# Altium schematic sheet STM32_Schematic.SchDoc
size A3; SheetNumber: 1; SheetTotal: 1
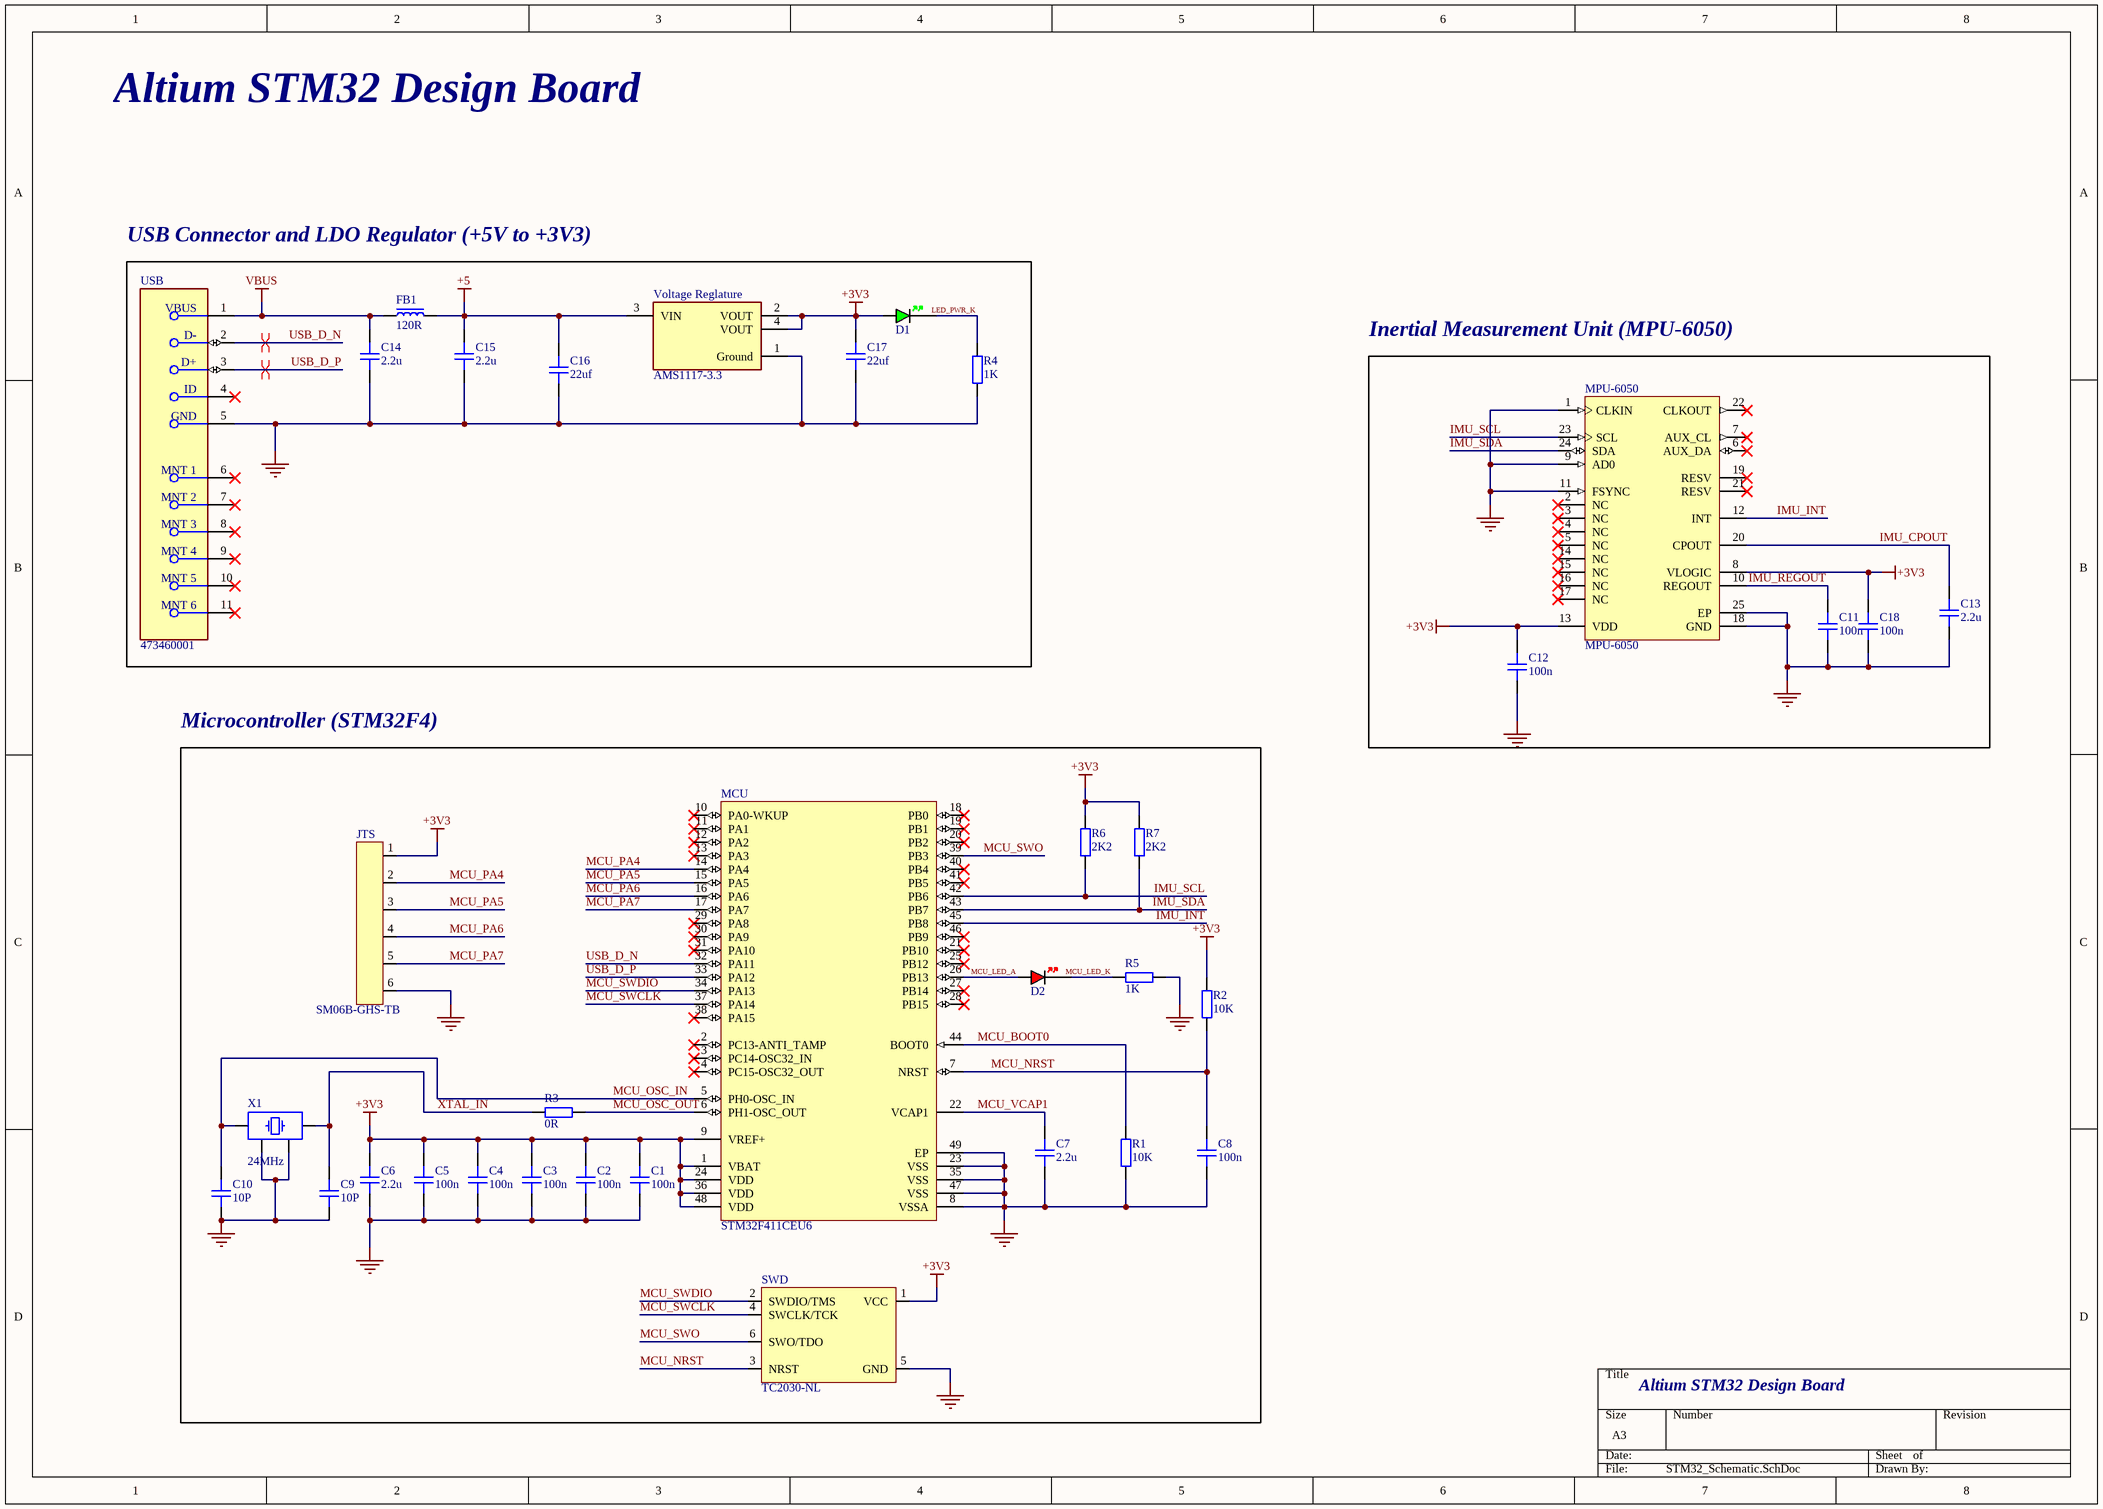
[diagram p0: STM32_Schematic.SchDoc]

## Parts
C1  100n  [CAP_0402]
C2  100n  [CAP_0402]
C3  100n  [CAP_0402]
C4  100n  [CAP_0402]
C5  100n  [CAP_0402]
C6  2.2u  [CAP_0603]
C7  2.2u  [CAP_0603]
C8  100n  [CAP_0402]
C9  10P  [CAP_0402]
C10  10P  [CAP_0402]
C11  100n  [CAP_0402]
C12  100n  [CAP_0402]
C13  2.2u  [CAP_0603]
C14  2.2u  [CAP_0603]
C15  2.2u  [CAP_0603]
C16  22uf  [CAP_0805]
C17  22uf  [CAP_0805]
C18  100n  [CAP_0402]
D1  GREEN  [LED_0402_GREEN]  (value not drawn)
D2  RED  [LED_0402_RED]  (value not drawn)
FB1  120R  [FB_0603]
JTS  SM06B-GHS-TB  [SM06B-GHS-TB]
MCU  STM32F411CEU6  [STM-UFQFPN48_L]
MPU-6050  MPU-6050  [IS-QFN-24_V]
R1  10K  [RES_0402]
R2  10K  [RES_0402]
R3  0R  [RES_0402]
R4  1K  [RES_0402]
R5  1K  [RES_0402]
R6  2K2  [RES_0402]
R7  2K2  [RES_0402]
SWD  TC2030-NL  [TC2030-NL-FP]  (no BOM)
USB  473460001  [FP-473460001-MFG]
Voltage_Reglature  AMS1117-3.3  [FP-AMS1117-IPC_C]
X1  24MHz  [XTAL_3225]

## Blocks framed on the sheet
USB Connector and LDO Regulator (+5V to +3V3): C14-C17 D1 FB1 R4 USB Voltage_Reglature
Inertial Measurement Unit (MPU-6050): C11-C13 C18 MPU-6050
Microcontroller (STM32F4): C1-C10 D2 JTS MCU R1-R3 R5-R7 SWD X1

## Nets
+3V3: C1.2 C2.2 C3.2 C4.2 C5.2 C6.2 C12.2 C17.2 C18.2 D1.A JTS.1 MCU.1(VBAT) MCU.9(VREF+) MCU.24(VDD) MCU.36(VDD) MCU.48(VDD) MPU-6050.8(VLOGIC) MPU-6050.13(VDD) R2.2 R6.2 R7.2 SWD.1(VCC) Voltage_Reglature.2(VOUT) Voltage_Reglature.4(VOUT)
+5: C15.2 C16.2 FB1.2 Voltage_Reglature.3(VIN)
GND: C1.1 C2.1 C3.1 C4.1 C5.1 C6.1 C7.1 C8.1 C9.1 C10.1 C11.1 C12.1 C13.1 C14.1 C15.1 C16.1 C17.1 C18.1 JTS.6 MCU.8(VSSA) MCU.23(VSS) MCU.35(VSS) MCU.47(VSS) MCU.49(EP) MPU-6050.1(CLKIN) MPU-6050.9(AD0) MPU-6050.11(FSYNC) MPU-6050.18(GND) MPU-6050.25(EP) R1.1 R4.1 R5.1 SWD.5(GND) USB.5(GND) Voltage_Reglature.1(Ground) X1.2 X1.4
VBUS: C14.2 FB1.1 USB.1(VBUS)
IMU_CPOUT: C13.2 MPU-6050.20(CPOUT)
IMU_INT: MCU.45(PB8) MPU-6050.12(INT)
IMU_REGOUT: C11.2 MPU-6050.10(REGOUT)
IMU_SCL: MCU.42(PB6) MPU-6050.23(SCL) R6.1
IMU_SDA: MCU.43(PB7) MPU-6050.24(SDA) R7.1
LED_PWR_K: D1.K R4.2
MCU_BOOT0: MCU.44(BOOT0) R1.2
MCU_LED_A: D2.A MCU.26(PB13)
MCU_LED_K: D2.K R5.2
MCU_NRST: C8.2 MCU.7(NRST) R2.1 SWD.3(NRST)
MCU_OSC_IN: C10.2 MCU.5(PH0-OSC_IN) X1.1
MCU_OSC_OUT: MCU.6(PH1-OSC_OUT) R3.2
MCU_PA4: JTS.2 MCU.14(PA4)
MCU_PA5: JTS.3 MCU.15(PA5)
MCU_PA6: JTS.4 MCU.16(PA6)
MCU_PA7: JTS.5 MCU.17(PA7)
MCU_SWCLK: MCU.37(PA14) SWD.4(SWCLK/TCK)
MCU_SWDIO: MCU.34(PA13) SWD.2(SWDIO/TMS)
MCU_SWO: MCU.39(PB3) SWD.6(SWO/TDO)
MCU_VCAP1: C7.2 MCU.22(VCAP1)
USB_D_N: MCU.32(PA11) USB.2(D-)
USB_D_P: MCU.33(PA12) USB.3(D+)
XTAL_IN: C9.2 R3.1 X1.3

Not connected (* = marked no-connect by the designer): MCU 2(PC13-ANTI_TAMP)* 3(PC14-OSC32_IN)* 4(PC15-OSC32_OUT)* 10(PA0-WKUP)* 11(PA1)* 12(PA2)* 13(PA3)* 18(PB0)* 19(PB1)* 20(PB2)* 21(PB10)* 25(PB12)* 27(PB14)* 28(PB15)* 29(PA8)* 30(PA9)* 31(PA10)* 38(PA15)* 40(PB4)* 41(PB5)* 46(PB9)*; MPU-6050 2(NC)* 3(NC)* 4(NC)* 5(NC)* 6(AUX_DA)* 7(AUX_CL)* 14(NC)* 15(NC)* 16(NC)* 17(NC)* 19(RESV)* 21(RESV)* 22(CLKOUT)*; USB 4(ID)* 6(MNT_1)* 7(MNT_2)* 8(MNT_3)* 9(MNT_4)* 10(MNT_5)* 11(MNT_6)*

## Layout directives
differential pair; differential pair class DIFF_USB: USB_D_N, USB_D_P

## Notes on the sheet
- Altium STM32 Design Board

## Library data of the parts
C1-C5 C8-C12 C18 = CAP_0402: Capacitor SMD 0402; Manufacturer: *; Manufacturer Part Number: *; Distributor Link: *; LCSC: *; Rating: *; Dielectric: *
C6 C7 C13-C15 = CAP_0603: Capacitor SMD 0603; Manufacturer: *; Manufacturer Part Number: *; Distributor Link: *; LCSC: *; Rating: *; Dielectric: *
C16 C17 = CAP_0805: Capacitor SMD 0805; Manufacturer: *; Manufacturer Part Number: *; Distributor Link: *; LCSC: *; Rating: *; Dielectric: *
D1 = LED_0402_GREEN: LED 0402 GREEN SMD
D2 = LED_0402_RED: LED 0402 RED SMD
FB1 = FB_0603: Ferrite Bead SMD 0603; Manufacturer: *; Manufacturer Part Number: *; Distributor Link: *; LCSC: *
JTS = SM06B-GHS-TB: Header Connector 6 Position 1.25MM Pitch SMD Horizontal JST GH; Manufacturer: JST; Manufacturer Part Number: SM06B-GHS-TB
MCU = CMP-0243-00165-1: ARM Cortex-M4 32-bit MCU+FPU, 512 KB Flash, 128 KB RAM, 36 I/Os, 48-Pin UFQFPN, -40 to 85 degC, Tray; Operating Frequency(F) (Processor speed) (MHz): 100; FLASH Size (Prog) (kB): 512; Internal RAM Size (kB): 128; I/Os (High Current): 36; Supply Voltage(Vcc) min (V): 1.7; Package Reference: 48-Pin Ultra Thin Fine Pitch Quad Flat No-Lead, 7 x 7 x 0.6 mm Body, 0.5 mm Pitch, Exposed Pad; ComponentLink1Description: Manufacturer URL; ComponentLink1URL: http://www.st.com/; Packing: Tray; Package Description: UFQFPN48; Core: ARM Cortex-M4; ComponentLink2Description: Datasheet; ComponentLink2URL: http://www.st.com/st-web-ui/static/active/en/resource/technical/document/datasheet/DM00115249.pdf; DatasheetVersion: Rev. 6; Mounting Technology: Surface Mount
MPU-6050 = CMP-1753-00002-2: 3-Axis Gyroscope, Accelerometer and a Digital Motion Processor(TM) (DMP), 2.375 to 3.46 V, -40 to 85 degC, 24-Pin QFN, RoHS, Tape and Reel; Manufacturer: InvenSense; Featured Product: MPU-60506-Axis,IntegratedI²CSolution; Other Names: 1428-1007-2 / MPU6050; Sensor Type: MotionTracking; Online Catalog: MPU-6000™Series; Unit PriceUSD: Digital; Datasheet Version: Rev. 3.3, 05/2012; Category: Sensors,Transducers; Datasheet URL: http://datasheet.octopart.com/MPU-6050-InvenSense-datasheet-14421344.pdf; Family: Multifunction; Standard Package: 5,000; Manufacturer URL: http://www.invensense.com/; Output Type: Digital; Dynamic Catalog: MPU-6000™Series
R1-R7 = RES_0402: Resistor SMD 0402; Manufacturer: *; Manufacturer Part Number: *; Distributor Link: *; LCSC: *
SWD = TC2030-NL: Tag-Connect No-Solder SWD Debug Connector (No Legs) DO NOT PLACE; Manufacturer: Tag-Connect; Manufacturer Part Number: TC2030-NL-FP
USB = CMP-2000-05246-2: CONN RCPT USB2.0 MICRO B SMD R/A; Manufacturer: Molex; Conn Orientation: Right Angle; Is Female: yes; Shielding: true; Pitch: 0.65mm; Number Of Contacts: 5; Voltage Rating: 30V; Current Rating: 1.8A; Device Class L2: USB Connectors; Digikey Description: CONN RCPT USB2.0 MICRO B SMD R/A; Height: 2.945mm; RoHS: TRUE; ComponentLink2Description: Datasheet; Octopart: https://octopart.com/47346-0001-molex-7164928; Automotive: No; Package: 0; Category: Conn; Device Class L1: Connectors; Usb Standard: USB 2.0; Temperature: -30°C to +85°C; Temperature Range Low: -30°C; Footprint Url: https://www.molex.com/pdm_docs/sd/473460001_sd.pdf; ComponentLink2URL: https://www.molex.com/webdocs/datasheets/pdf/en-us/0473460001_IO_CONNECTORS.pdf; Lead Free: Yes; Manufacturer Part Number: 473460001; Contact Material: Gold,Nickel; Temperature Range High: +85°C; Device Class L3: unset
Voltage_Reglature = CMP-209535-000001-1: LDO Voltage Regulators 1A, 3.3V; Manufacturer: Advanced Monolithic Systems; Dropout Voltage: 1.1V; Output Type: Fixed; Nominal Supply Current: 5mA; Max Power Dissipation: 1.2W; Max Supply Voltage: 15V; Number Of Outputs: 1; Standoff Height: 0.64mm; Max Junction Temp: +125°C; Height: 1.8mm; Package: AMS1117; Device Class L2: Power Management ICs; ComponentLink2Description: Datasheet; ComponentLink2URL: http://www.advanced-monolithic.com/pdf/ds1117.pdf; Category: IC; RoHS: TRUE; Automotive: No; Device Class L1: Integrated Circuits (ICs); Output Current: 1A; Device Class L3: Voltage Regulators - Linear; Temperature: -40°C to +125°C; Output Voltage: 3.3V; Manufacturer Part Number: AMS1117-3.3; Temperature Range Low: -40°C; Octopart: https://octopart.com/ams1117-3.3-advanced+monolithic+systems-25899300; Lead Free: Yes; Ipc Land Pattern Name: SOT229P700X180-4; Temperature Range High: +125°C
X1 = TSX-3225_24.0000MF15X-AC: Crystal SMD 24MHz 10PPM 7pF 3225; Manufacturer: Epson; Manufacturer Part Number: TSX-3225 24.0000MF15X-AC